# EAGLE design homeweather (EAGLE 6.1)
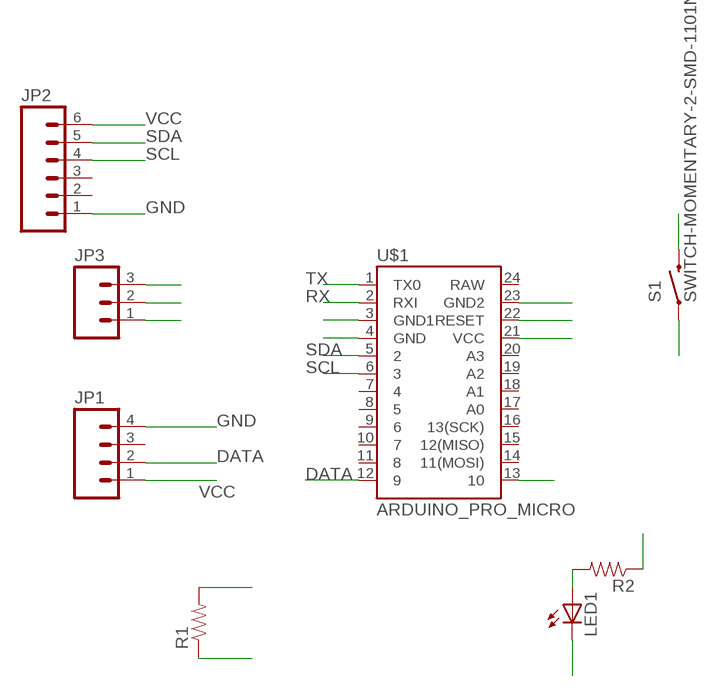
[diagram p0: schematic, sheet 1]

## Parts
JP1  M04PTH  [1X04]
JP2  M06SIP  [1X06]
JP3  M03PTH  [1X03]
LED1  LED3MM  [LED3MM]
R1  RESISTOR0805-RES  [0805]
R2  RESISTOR0805-RES  [0805]
S1  SWITCH-MOMENTARY-2-SMD-1101NE  [TACTILE-SWITCH-1101NE]
U$1  ARDUINO_PRO_MICRO  [ARDUINO_PRO_MICRO]

## Nets
DATA: JP1.2 R1.2 U$1.12
GND: JP1.4 JP2.1 JP3.1 LED1.K(C) S1.P$1 U$1.3(GND1) U$1.4(GND) U$1.23(GND2)
LED1: R2.1 U$1.13
N$1: LED1.A R2.2
RESET: S1.P$2 U$1.22(RESET)
RX: JP3.2 U$1.2(RXI)
SCL: JP2.4 U$1.6
SDA: JP2.5 U$1.5
TX: JP3.3 U$1.1(TX0)
VCC: JP1.1 JP2.6 R1.1 U$1.21(VCC)
Unconnected: JP1.3 JP2.2 JP2.3 U$1.7 U$1.8 U$1.9 U$1.10 U$1.11 U$1.14(11(MOSI)) U$1.15(12(MISO)) U$1.16(13(SCK)) U$1.17(A0) U$1.18(A1) U$1.19(A2) U$1.20(A3) U$1.24(RAW)

## Library data of the parts
JP1 = SparkFun-Connectors:M04: Header 4 Standard 4-pin 0.1" header. Use with straight break away headers (SKU : PRT-00116), right angle break away headers (PRT-00553), swiss pins (PRT-00743), machine pins (PRT-00117), and female headers (PRT-00115). Molex polarized connector foot print use with SKU : PRT-08231 with associated crimp pins and housings. 1MM SMD Version SKU: PRT-10208
JP2 = SparkFun-Connectors:M06: Header 6 Standard 6-pin 0.1" header. Use with straight break away headers (SKU : PRT-00116), right angle break away headers (PRT-00553), swiss pins (PRT-00743), machine pins (PRT-00117), and female headers (PRT-00115). Molex polarized connector foot print use with SKU : PRT-08094 with associated crimp pins and housings. NOTES ON THE VARIANTS LOCK and LOCK_LONGPADS... This footprint was designed to help hold the alignment of a through-hole component (i.e. 6-pin header) while soldering it into place. You may notice that each hole has been shifted either up or down by 0.005 of an inch from it's more standard position (which is a perfectly straight line). This slight alteration caused the pins (the squares in the middle) to touch the edges of the holes. Because they are alternating, it causes a "brace" to hold the component in place. 0.005 has proven to be the perfect amount of "off-center" position when using our standard breakaway headers. Although looks a little odd when you look at the bare footprint, once you have a header in there, the alteration is very hard to notice. Also,if you push a header all the way into place, it is covered up entirely on the bottom side. This idea of altering the position of holes to aid alignment will be further integrated into the Sparkfun Library for other footprints. It can help hold any component with 3 or more connection pins.
JP3 = SparkFun-Connectors:M03: Header 3 Standard 3-pin 0.1" header. Use with straight break away headers (SKU : PRT-00116), right angle break away headers (PRT-00553), swiss pins (PRT-00743), machine pins (PRT-00117), and female headers (PRT-00115). Molex polarized connector foot print use with SKU : PRT-08232 with associated crimp pins and housings.
LED1 = SparkFun-LED:LED: LEDs Standard schematic elements and footprints for 5mm, 3mm, 1206, and 0603 sized LEDs. 5mm - Spark Fun Electronics SKU : COM-00529 (and others)
R1 R2 = SparkFun-Resistors:RESISTOR: Resistor Basic schematic elements and footprints for 0603, 1206, and PTH resistors.
S1 = SparkFun-Electromechanical:SWITCH-MOMENTARY-2: Various NO switches- pushbuttons, reed, etc
U$1 = SparkFun-Boards:ARDUINO_PRO_MICRO

## Board
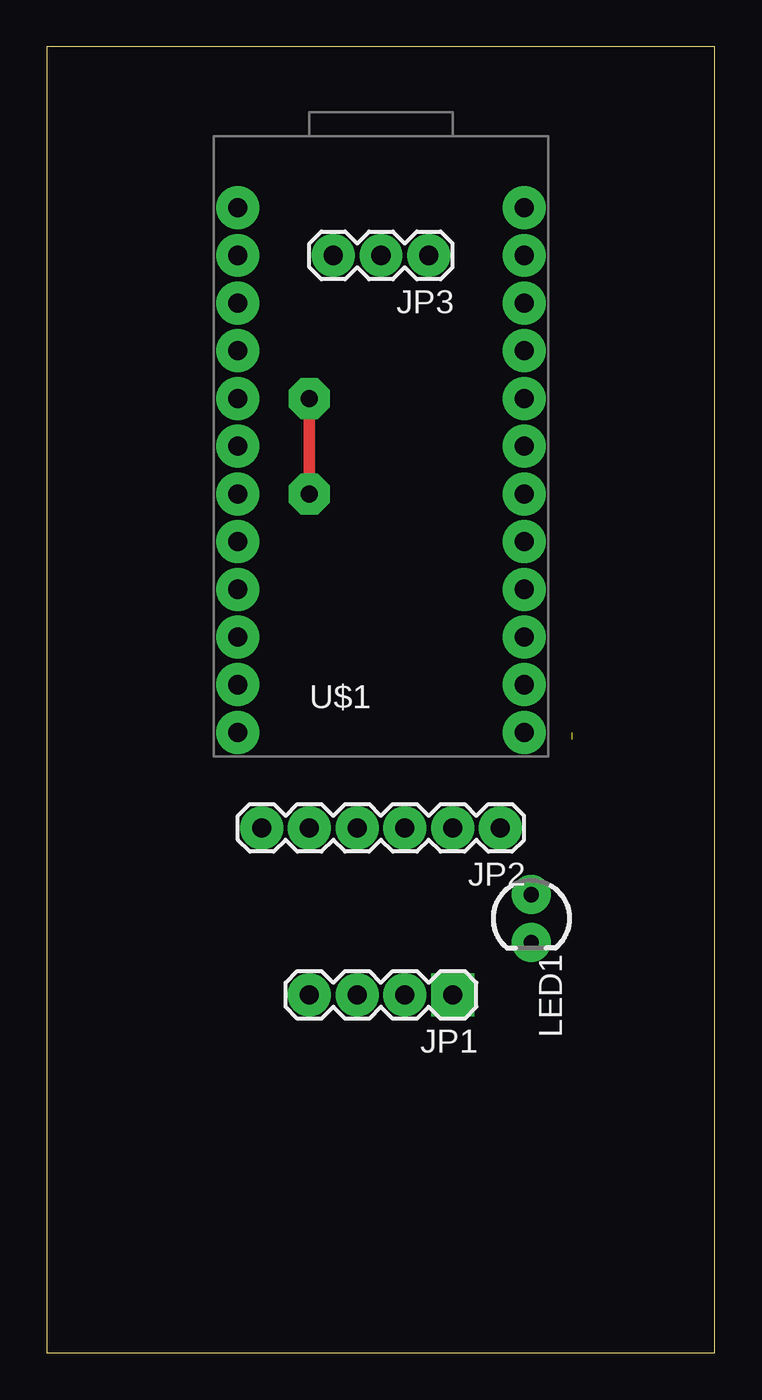
[diagram p1: board, top side]
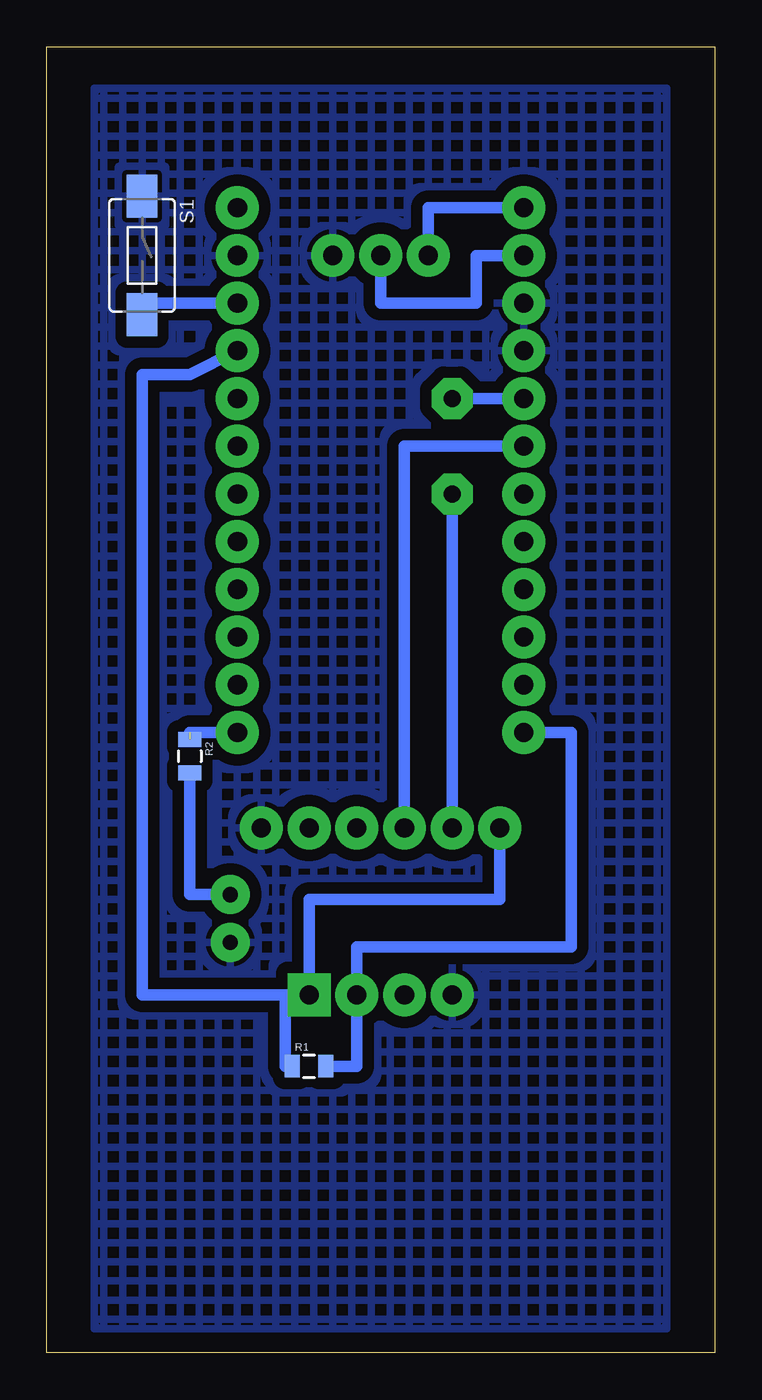
[diagram p2: board, bottom side, seen from below]

Size 35.54 x 69.52 mm. Coordinates in mm from the lower left corner, seen from the top.
Outline: 0,0 35.54,0 35.54,69.52 0,69.52 0,0
Copper layers (1*16): Top 0.035mm / dielectric 1.5mm / Bottom 0.035mm
Design rules: minimum track width 10mil, minimum drill 32mil, track to track 12mil, track to pad 12mil, pad to pad 12mil, via to via 12mil, smd to smd 8mil, copper to edge 40mil, drill to drill 40mil, minimum pad ring 25mil, minimum via ring 12mil, stop-mask expansion 4mil, vias tented up to drill 0mil, thermal gap 10mil

### Footprints (pad centres in the part's own frame; a part is rotated, then mirrored left to right if it is on the bottom)
1X04 = drill 1.016 pad 1.88 square: 1 0,0 | drill 1.016 pad 1.88: 2 2.54,0; 3 5.08,0; 4 7.62,0
1X06 = drill 1.016 pad 1.88: 1 0,0; 2 2.54,0; 3 5.08,0; 4 7.62,0; 5 10.16,0; 6 12.7,0
1X03 = drill 1.016 pad 1.88: 1 0,0; 2 2.54,0; 3 5.08,0
LED3MM = drill 0.813 pad 1.88: A -1.27,0; K 1.27,0
0805 = smd 0.8 x 1.2: 1 -0.9,0; 2 0.9,0
TACTILE-SWITCH-1101NE = smd 2.3 x 1.6: P$1 -3.15,0; P$2 3.15,0
ARDUINO_PRO_MICRO = drill 1.016 pad 1.88: 1 -7.62,12.7; 2 -7.62,10.16; 3 -7.62,7.62; 4 -7.62,5.08; 5 -7.62,2.54; 6 -7.62,0; 7 -7.62,-2.54; 8 -7.62,-5.08; 9 -7.62,-7.62; 10 -7.62,-10.16; 11 -7.62,-12.7; 12 -7.62,-15.24; 13 7.62,-15.24; 14 7.62,-12.7; 15 7.62,-10.16; 16 7.62,-7.62; 17 7.62,-5.08; 18 7.62,-2.54; 19 7.62,0; 20 7.62,2.54; 21 7.62,5.08; 22 7.62,7.62; 23 7.62,10.16; 24 7.62,12.7

### Placement (x,y rotation side)
JP1  21.59,19.05 180 top
JP2  24.13,27.94 180 top
JP3  20.32,58.42 180 top
LED1  25.78,23.11 270 top
R1  21.59,15.24 0 bottom
R2  27.94,31.75 270 bottom
S1  30.48,58.42 270 bottom
U$1  17.78,48.26 0 top

### Tracks (layer width: path | path; a pad name or v marks a point on that pad's centre or on a via)
DATA
  Bottom 0.61: R1.2 19.05,15.24 JP1.2 19.05,21.59 7.62,21.59 7.62,33.02 U$1.12
GND
  pour Bottom (isolate 0.61, hatched): 2.54,67.31 2.54,1.27 33.02,1.27 33.02,67.31
LED1  (1 unrouted)
  Bottom 0.61: U$1.13 27.94,33.02
N$1
  Bottom 0.61: R2.2 27.94,24.38 LED1.A
RESET
  Bottom 0.61: S1.P$2 30.48,55.88 U$1.22
RX
  Bottom 0.61: JP3.2 17.78,55.88 12.7,55.88 12.7,58.42 U$1.2
SCL
  Bottom 0.61: JP2.4 16.51,48.26 U$1.6
SDA  (via drill 0.9 pad 2.18)
  Top 0.61: v13.97,45.72 v13.97,50.8
  Bottom 0.61: JP2.5 v13.97,45.72 | v13.97,50.8 U$1.5
TX
  Bottom 0.61: JP3.3 15.24,60.96 U$1.1
VCC
  Bottom 0.61: U$1.21 27.94,52.07 30.48,52.07 30.48,19.05 22.86,19.05 | JP2.6 11.43,24.13 21.59,24.13 JP1.1 22.86,19.05 | R1.1 22.86,15.24 22.86,19.05